# EAGLE design board (EAGLE 9.6.2)
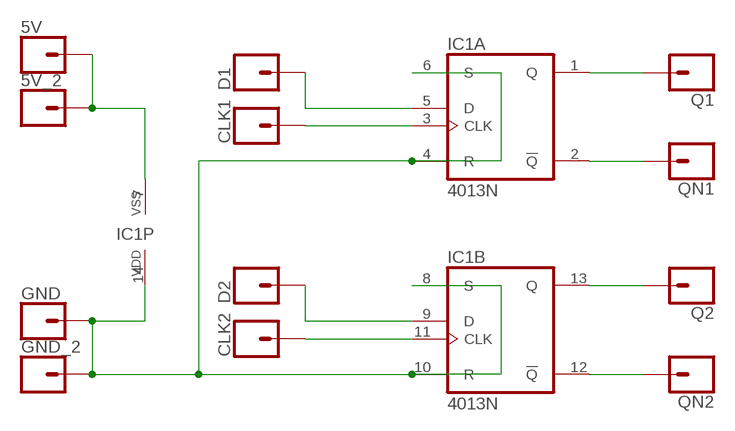
[diagram p0: schematic, sheet 1]

## Parts
5V  CONN_01  [1X01]
5V_2  CONN_01  [1X01]
CLK1  CONN_01  [1X01]
CLK2  CONN_01  [1X01]
D1  CONN_01  [1X01]
D2  CONN_01  [1X01]
GND  CONN_01  [1X01]
GND_2  CONN_01  [1X01]
IC1  4013N  [DIL14]
Q1  CONN_01  [1X01]
Q2  CONN_01  [1X01]
QN1  CONN_01  [1X01]
QN2  CONN_01  [1X01]

## Nets
N$1: 5V.1 5V_2.1 IC1.7(P:VSS)
N$2: D1.1 IC1.5(A:D)
N$3: IC1.13(B:Q) Q2.1
N$4: IC1.1(A:Q) Q1.1
N$5: CLK1.1 IC1.3(A:CLK)
N$6: D2.1 IC1.9(B:D)
N$7: CLK2.1 IC1.11(B:CLK)
N$8: IC1.2(A:!Q) QN1.1
N$9: IC1.12(B:!Q) QN2.1
N$13: GND.1 GND_2.1 IC1.4(A:R) IC1.6(A:S) IC1.8(B:S) IC1.10(B:R) IC1.14(P:VDD)

## Library data of the parts
5V 5V_2 CLK1 CLK2 D1 D2 GND GND_2 Q1 Q2 QN1 QN2 = SparkFun-Connectors:CONN_01: Single connection point. Often used as Generic Header-pin footprint for 0.1 inch spaced/style header connections On any of the 0.1 inch spaced packages, you can populate with these: Break Away Headers - Straight <https://www.sparkfun.com/products/116> (PRT-00116) Break Away Male Headers - Right Angle <https://www.sparkfun.com/products/553> (PRT-00553) Female Headers <https://www.sparkfun.com/products/115> (PRT-00115) Break Away Headers - Machine Pin <https://www.sparkfun.com/products/117> (PRT-00117) Break Away Female Headers - Swiss Machine Pin <https://www.sparkfun.com/products/743> (PRT-00743) This device is also useful as a general connection point to wire up your design to another part of your project. Our various solder wires solder well into these plated through hole pads. Hook-Up Wire - Assortment (Stranded, 22 AWG) <https://www.sparkfun.com/products/11375> (PRT-11375) Hook-Up Wire - Assortment (Solid Core, 22 AWG) <https://www.sparkfun.com/products/11367> (PRT-11367) View the entire wire category on our website here <https://www.sparkfun.com/categories/141> Special notes: SMTSO-256-ET is a "flush mount" nut for a 4-40 screw. We mostly use this on specialty testbeds; it is a nice way to connect hardware to your PCB at an adjustable hieght. Also note, the SNAP packages are for using a snappable style connector. We sell a baggie of snaps and they are also used on two LilyPad designs: Snap Assortment - 30 pack (male and female) <https://www.sparkfun.com/products/11347> (DEV-11347) LilyPad Arduino SimpleSnap <https://www.sparkfun.com/products/10941> (DEV-10941) LilyPad SimpleSnap Protoboard <https://www.sparkfun.com/products/10940> (DEV-10940)
IC1 = 40xx:4013: Dual D FLIP FLOP, set/reset

## Board
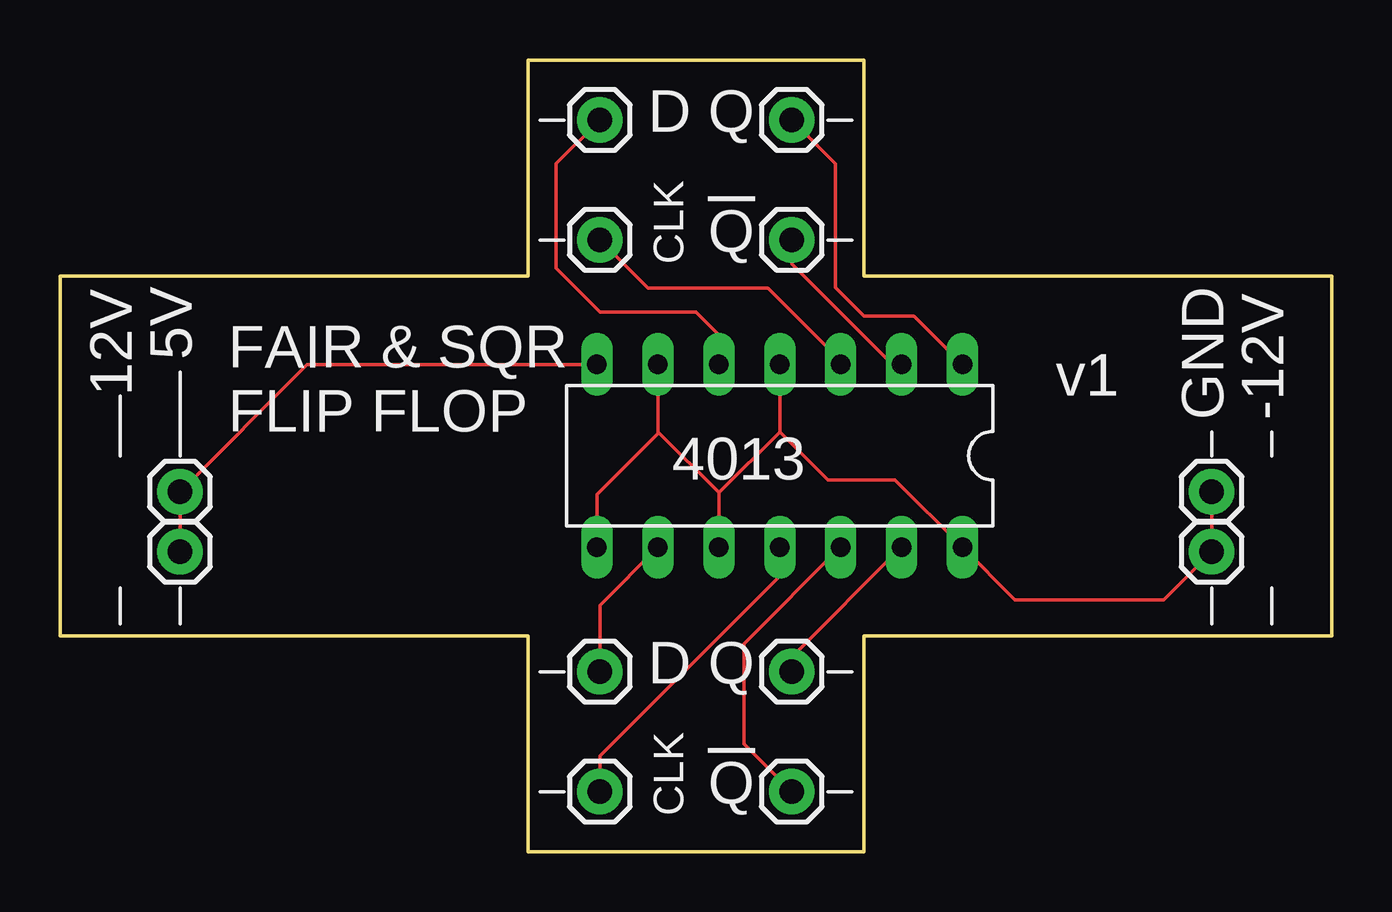
[diagram p1: board, top side]

Size 53 x 33 mm. Coordinates in mm from the lower left corner, seen from the top.
Outline: 19.5,0 19.5,9 0,9 0,24 19.5,24 19.5,33 33.5,33 33.5,24 53,24 53,9 33.5,9 33.5,0 19.5,0
Copper layers (1*16): Top 0.035mm / dielectric 1.5mm / Bottom 0.035mm
Design rules "default": minimum track width 6mil, minimum drill 0.35mm, track to track 6mil, track to pad 6mil, pad to pad 6mil, via to via 6mil, smd to smd 6mil, copper to edge 40mil, drill to drill 6mil, minimum pad ring 10mil, minimum via ring 8mil, stop-mask expansion 4mil, vias tented up to drill 0mil, thermal gap 10mil

### Footprints (pad centres in the part's own frame; a part is rotated, then mirrored left to right if it is on the bottom)
1X01 = drill 1.016 pad 1.88: 1 0,0
DIL14 = drill 0.813 long: 1 -7.62,-3.81; 2 -5.08,-3.81; 3 -2.54,-3.81; 4 0,-3.81; 5 2.54,-3.81; 6 5.08,-3.81; 7 7.62,-3.81; 8 7.62,3.81; 9 5.08,3.81; 10 2.54,3.81; 11 0,3.81; 12 -2.54,3.81; 13 -5.08,3.81; 14 -7.62,3.81

### Placement (x,y rotation side)
5V  5,15 0 top
5V_2  5,12.5 0 top
CLK1  22.5,25.5 0 top
CLK2  22.5,2.5 0 top
D1  22.5,30.5 0 top
D2  22.5,7.5 0 top
GND  48,15 0 top
GND_2  48,12.5 0 top
IC1  30,16.5 180 top
Q1  30.5,30.5 0 top
Q2  30.5,7.5 0 top
QN1  30.5,25.5 0 top
QN2  30.5,2.5 0 top

### Tracks (layer width: path | path; a pad name or v marks a point on that pad's centre or on a via)
N$1
  Top 0.152: 5V_2.1 5V.1 10.31,20.31 IC1.7
N$2
  Top 0.152: IC1.5 27.46,21.54 26.5,22.5 22.5,22.5 20.67,24.33 20.67,28.67 D1.1
N$3
  Top 0.152: Q2.1 30.5,8.11 IC1.13
N$4
  Top 0.152: Q1.1 32.33,28.67 32.33,23.52 33.52,22.33 35.6,22.33 IC1.1
N$5
  Top 0.152: IC1.3 32.54,20.46 29.5,23.5 24.5,23.5 CLK1.1
N$6
  Top 0.152: D2.1 22.5,10.27 IC1.9
N$7
  Top 0.152: CLK2.1 22.5,4 30,11.5 IC1.11
N$8
  Top 0.152: IC1.2 34.69,20.31 30.5,24.5 QN1.1
N$9
  Top 0.152: IC1.12 28.5,8.65 28.5,4.5 QN2.1
N$13
  Top 0.152: GND.1 GND_2.1 46,10.5 39.81,10.5 IC1.14 34.81,15.5 32,15.5 30,17.5 | IC1.10 27.46,14.96 | 27.46,14.96 30,17.5 | 30,17.5 IC1.4 | IC1.8 22.38,14.88 24.92,17.42 24.92,17.5 | 24.92,17.5 IC1.6 | 27.46,14.96 24.92,17.5

### Text on the board
tPlace: D | Q | !Q | CLK | 5V | 12V | v1 | FAIR & SQR / FLIP FLOP | GND | -12V | 4013 | D | Q | CLK | !Q